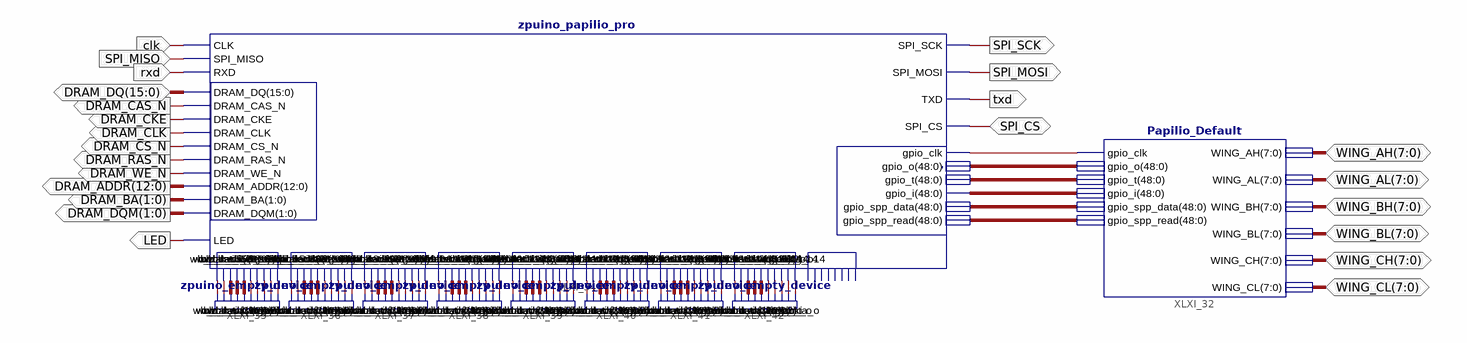
[diagram p0: schematic sheet 1]
// Xilinx ISE schematic Papilio_SOC_Base.sch (spartan6) as structural Verilog: 10 symbols, 24 ports
module Papilio_SOC_Base (
  input  clk,
  input  SPI_MISO,
  input  rxd,
  inout  [7:0] WING_AH,
  inout  [7:0] WING_AL,
  inout  [7:0] WING_BH,
  inout  [7:0] WING_BL,
  inout  [7:0] WING_CH,
  inout  [7:0] WING_CL,
  inout  SPI_CS,
  inout  [15:0] DRAM_DQ,
  output SPI_SCK,
  output SPI_MOSI,
  output txd,
  output LED,
  output [1:0] DRAM_DQM,
  output [1:0] DRAM_BA,
  output [12:0] DRAM_ADDR,
  output DRAM_WE_N,
  output DRAM_RAS_N,
  output DRAM_CS_N,
  output DRAM_CLK,
  output DRAM_CKE,
  output DRAM_CAS_N
);

  wire XLXN_440, XLXN_446, XLXN_447, XLXN_451, XLXN_452, XLXN_453, XLXN_454, XLXN_455, XLXN_456, XLXN_457,
       XLXN_461, XLXN_462, XLXN_463, XLXN_464, XLXN_465, XLXN_466, XLXN_467, XLXN_471, XLXN_472, XLXN_473,
       XLXN_474, XLXN_475, XLXN_476, XLXN_477, XLXN_481, XLXN_482, XLXN_483, XLXN_484, XLXN_485, XLXN_486,
       XLXN_487, XLXN_491, XLXN_492, XLXN_493, XLXN_494, XLXN_495, XLXN_496, XLXN_497, XLXN_501, XLXN_502,
       XLXN_503, XLXN_504, XLXN_505, XLXN_506, XLXN_507, XLXN_511, XLXN_512, XLXN_513, XLXN_514, XLXN_515,
       XLXN_516, XLXN_517, XLXN_521, XLXN_522, XLXN_523, XLXN_524, XLXN_525;
  wire [26:2] XLXN_450, XLXN_460, XLXN_470, XLXN_480, XLXN_490, XLXN_500, XLXN_510, XLXN_520;
  wire [31:0] XLXN_448, XLXN_449, XLXN_458, XLXN_459, XLXN_468, XLXN_469, XLXN_478, XLXN_479, XLXN_488,
       XLXN_489, XLXN_498, XLXN_499, XLXN_508, XLXN_509, XLXN_518, XLXN_519;
  wire [48:0] XLXN_441, XLXN_442, XLXN_443, XLXN_444, XLXN_445;

  Papilio_Default XLXI_32 (
    .gpio_clk(XLXN_440), .gpio_o(XLXN_441), .gpio_t(XLXN_442), .gpio_i(XLXN_443), .gpio_spp_data(XLXN_444),
    .gpio_spp_read(XLXN_445), .WING_AH(WING_AH), .WING_AL(WING_AL), .WING_BH(WING_BH), .WING_BL(WING_BL),
    .WING_CH(WING_CH), .WING_CL(WING_CL));
  zpuino_papilio_pro XLXI_34 (
    .wb_clk_i5(XLXN_446), .wb_rst_i5(XLXN_447), .wb_dat_o5(XLXN_448), .wb_dat_i5(XLXN_449),
    .wb_adr_i5(XLXN_450), .wb_we_i5(XLXN_451), .wb_cyc_i5(XLXN_452), .wb_stb_i5(XLXN_453),
    .wb_ack_o5(XLXN_454), .wb_inta_o5(XLXN_455), .wb_clk_i8(XLXN_456), .wb_rst_i8(XLXN_457),
    .wb_dat_o8(XLXN_458), .wb_dat_i8(XLXN_459), .wb_adr_i8(XLXN_460), .wb_we_i8(XLXN_461),
    .wb_cyc_i8(XLXN_462), .wb_stb_i8(XLXN_463), .wb_ack_o8(XLXN_464), .wb_inta_o8(XLXN_465),
    .wb_clk_i9(XLXN_466), .wb_rst_i9(XLXN_467), .wb_dat_o9(XLXN_468), .wb_dat_i9(XLXN_469),
    .wb_adr_i9(XLXN_470), .wb_we_i9(XLXN_471), .wb_cyc_i9(XLXN_472), .wb_stb_i9(XLXN_473),
    .wb_ack_o9(XLXN_474), .wb_inta_o9(XLXN_475), .wb_clk_i10(XLXN_476), .wb_rst_i10(XLXN_477),
    .wb_dat_o10(XLXN_478), .wb_dat_i10(XLXN_479), .wb_adr_i10(XLXN_480), .wb_we_i10(XLXN_481),
    .wb_cyc_i10(XLXN_482), .wb_stb_i10(XLXN_483), .wb_ack_o10(XLXN_484), .wb_inta_o10(XLXN_485),
    .wb_clk_i11(XLXN_486), .wb_rst_i11(XLXN_487), .wb_dat_o11(XLXN_488), .wb_dat_i11(XLXN_489),
    .wb_adr_i11(XLXN_490), .wb_we_i11(XLXN_491), .wb_cyc_i11(XLXN_492), .wb_stb_i11(XLXN_493),
    .wb_ack_o11(XLXN_494), .wb_inta_o11(XLXN_495), .wb_clk_i12(XLXN_496), .wb_rst_i12(XLXN_497),
    .wb_dat_o12(XLXN_498), .wb_dat_i12(XLXN_499), .wb_adr_i12(XLXN_500), .wb_we_i12(XLXN_501),
    .wb_cyc_i12(XLXN_502), .wb_stb_i12(XLXN_503), .wb_ack_o12(XLXN_504), .wb_inta_o12(XLXN_505),
    .wb_clk_i13(XLXN_506), .wb_rst_i13(XLXN_507), .wb_dat_o13(XLXN_508), .wb_dat_i13(XLXN_509),
    .wb_adr_i13(XLXN_510), .wb_we_i13(XLXN_511), .wb_cyc_i13(XLXN_512), .wb_stb_i13(XLXN_513),
    .wb_ack_o13(XLXN_514), .wb_inta_o13(XLXN_515), .wb_clk_i14(XLXN_516), .wb_rst_i14(XLXN_517),
    .wb_dat_o14(XLXN_518), .wb_dat_i14(XLXN_519), .wb_adr_i14(XLXN_520), .wb_we_i14(XLXN_521),
    .wb_cyc_i14(XLXN_522), .wb_stb_i14(XLXN_523), .wb_ack_o14(XLXN_524), .wb_inta_o14(XLXN_525),
    .SPI_SCK(SPI_SCK), .SPI_MOSI(SPI_MOSI), .TXD(txd), .SPI_CS(SPI_CS), .gpio_clk(XLXN_440),
    .gpio_t(XLXN_442), .gpio_o(XLXN_441), .gpio_i(XLXN_443), .gpio_spp_data(XLXN_444),
    .gpio_spp_read(XLXN_445), .CLK(clk), .SPI_MISO(SPI_MISO), .RXD(rxd), .DRAM_DQ(DRAM_DQ), .LED(LED),
    .DRAM_CAS_N(DRAM_CAS_N), .DRAM_CKE(DRAM_CKE), .DRAM_CLK(DRAM_CLK), .DRAM_CS_N(DRAM_CS_N),
    .DRAM_RAS_N(DRAM_RAS_N), .DRAM_WE_N(DRAM_WE_N), .DRAM_ADDR(DRAM_ADDR), .DRAM_BA(DRAM_BA),
    .DRAM_DQM(DRAM_DQM));  // open: v_wb_dat_o, v_wb_dat_i, v_wb_adr_i, v_wb_we_i, v_wb_cyc_i, v_wb_stb_i, v_wb_ack_o, vgaclkout
  zpuino_empty_device XLXI_35 (
    .wb_clk_i(XLXN_446), .wb_rst_i(XLXN_447), .wb_dat_o(XLXN_448), .wb_dat_i(XLXN_449), .wb_adr_i(XLXN_450),
    .wb_we_i(XLXN_451), .wb_cyc_i(XLXN_452), .wb_stb_i(XLXN_453), .wb_ack_o(XLXN_454), .wb_inta_o(XLXN_455));
  zpuino_empty_device XLXI_36 (
    .wb_clk_i(XLXN_456), .wb_rst_i(XLXN_457), .wb_dat_o(XLXN_458), .wb_dat_i(XLXN_459), .wb_adr_i(XLXN_460),
    .wb_we_i(XLXN_461), .wb_cyc_i(XLXN_462), .wb_stb_i(XLXN_463), .wb_ack_o(XLXN_464), .wb_inta_o(XLXN_465));
  zpuino_empty_device XLXI_37 (
    .wb_clk_i(XLXN_466), .wb_rst_i(XLXN_467), .wb_dat_o(XLXN_468), .wb_dat_i(XLXN_469), .wb_adr_i(XLXN_470),
    .wb_we_i(XLXN_471), .wb_cyc_i(XLXN_472), .wb_stb_i(XLXN_473), .wb_ack_o(XLXN_474), .wb_inta_o(XLXN_475));
  zpuino_empty_device XLXI_38 (
    .wb_clk_i(XLXN_476), .wb_rst_i(XLXN_477), .wb_dat_o(XLXN_478), .wb_dat_i(XLXN_479), .wb_adr_i(XLXN_480),
    .wb_we_i(XLXN_481), .wb_cyc_i(XLXN_482), .wb_stb_i(XLXN_483), .wb_ack_o(XLXN_484), .wb_inta_o(XLXN_485));
  zpuino_empty_device XLXI_39 (
    .wb_clk_i(XLXN_486), .wb_rst_i(XLXN_487), .wb_dat_o(XLXN_488), .wb_dat_i(XLXN_489), .wb_adr_i(XLXN_490),
    .wb_we_i(XLXN_491), .wb_cyc_i(XLXN_492), .wb_stb_i(XLXN_493), .wb_ack_o(XLXN_494), .wb_inta_o(XLXN_495));
  zpuino_empty_device XLXI_40 (
    .wb_clk_i(XLXN_496), .wb_rst_i(XLXN_497), .wb_dat_o(XLXN_498), .wb_dat_i(XLXN_499), .wb_adr_i(XLXN_500),
    .wb_we_i(XLXN_501), .wb_cyc_i(XLXN_502), .wb_stb_i(XLXN_503), .wb_ack_o(XLXN_504), .wb_inta_o(XLXN_505));
  zpuino_empty_device XLXI_41 (
    .wb_clk_i(XLXN_506), .wb_rst_i(XLXN_507), .wb_dat_o(XLXN_508), .wb_dat_i(XLXN_509), .wb_adr_i(XLXN_510),
    .wb_we_i(XLXN_511), .wb_cyc_i(XLXN_512), .wb_stb_i(XLXN_513), .wb_ack_o(XLXN_514), .wb_inta_o(XLXN_515));
  zpuino_empty_device XLXI_42 (
    .wb_clk_i(XLXN_516), .wb_rst_i(XLXN_517), .wb_dat_o(XLXN_518), .wb_dat_i(XLXN_519), .wb_adr_i(XLXN_520),
    .wb_we_i(XLXN_521), .wb_cyc_i(XLXN_522), .wb_stb_i(XLXN_523), .wb_ack_o(XLXN_524), .wb_inta_o(XLXN_525));
endmodule
